# Altium schematic sheet geneva-interface.SchDoc
size A4
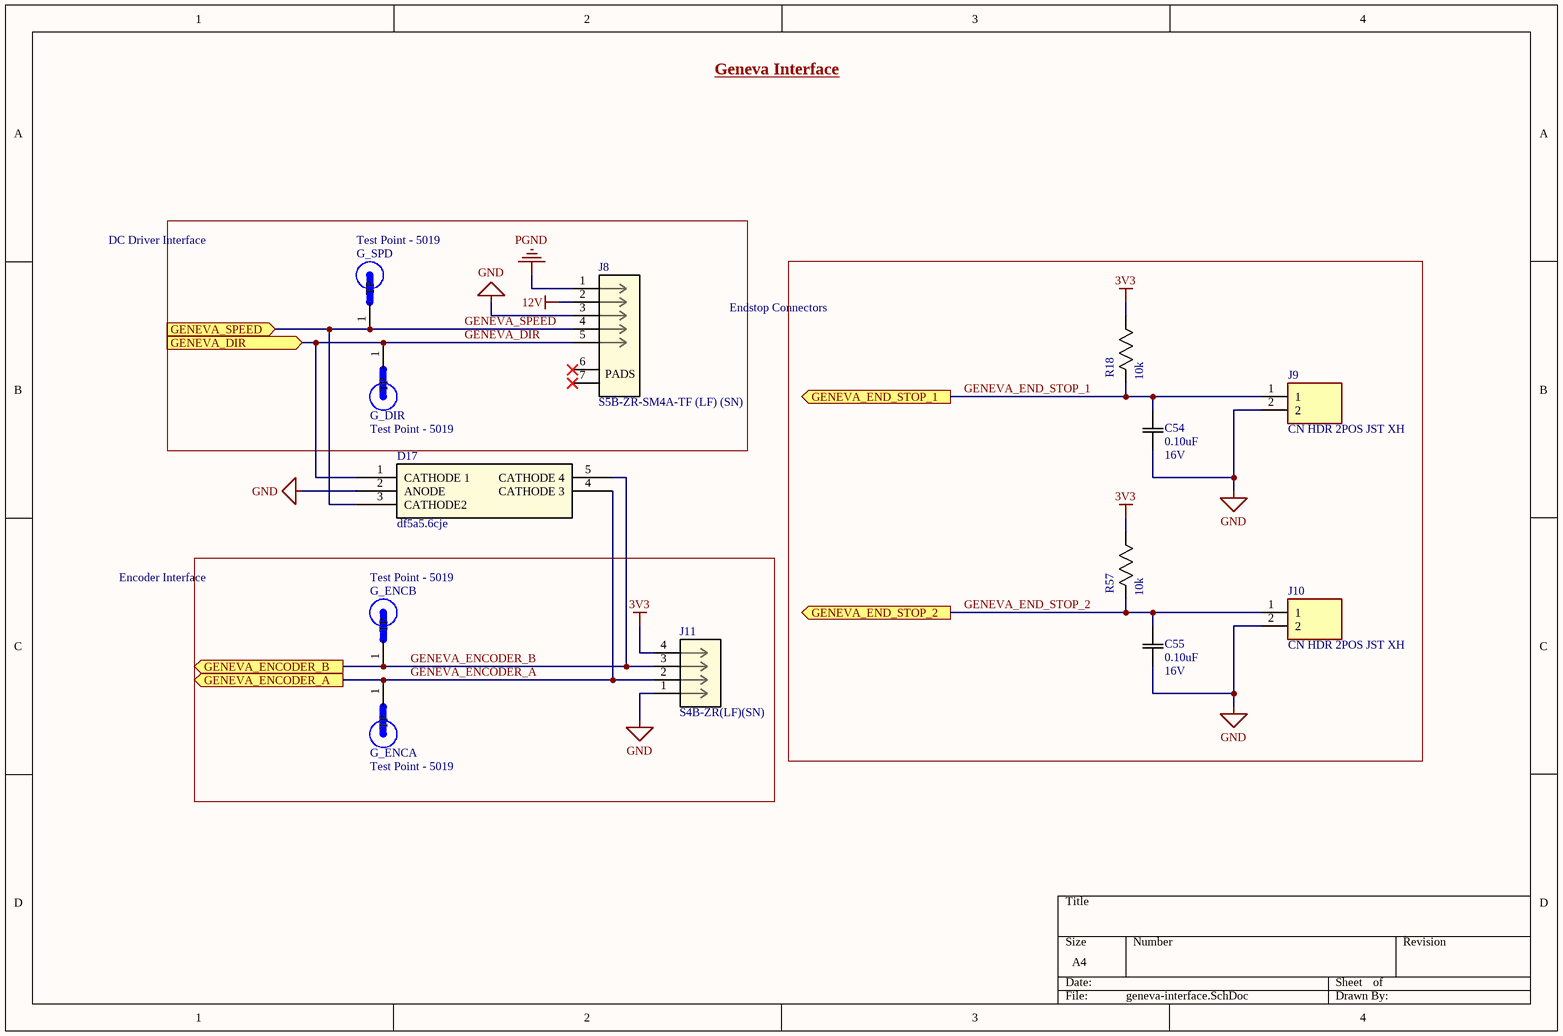
[diagram p0: geneva-interface.SchDoc]

## Parts
C54  Rating: 16V  [0603]  (hidden comment: 0.10uF)
C55  Rating: 16V  [0603]  (hidden comment: 0.10uF)
D17  df5a5.6cje  [ESV_TOS-L]
G_DIR  Test Point - 5019  [TP380X203]
G_ENCA  Test Point - 5019  [TP380X203]
G_ENCB  Test Point - 5019  [TP380X203]
G_SPD  Test Point - 5019  [TP380X203]
J8  S5B-ZR-SM4A-TF (LF) (SN)  [JST_S5B-ZR-SM4A-TF]
J9  CN HDR 2POS JST XH  [JST_S2B-XH-A(LF)(SN)]
J10  CN HDR 2POS JST XH  [JST_S2B-XH-A(LF)(SN)]
J11  S4B-ZR(LF)(SN)  [CN S4B-ZR(LF)(SN)_JST]
R18  10k  [0603]
R57  10k  [0603]

## Blocks framed on the sheet
DC Driver Interface: G_DIR G_SPD J8
Endstop Connectors: C54 C55 J9 J10 R18 R57
Encoder Interface: G_ENCA G_ENCB J11

## Ports
GENEVA_DIR (in), GENEVA_ENCODER_A (out), GENEVA_ENCODER_B (out), GENEVA_END_STOP_1 (out), GENEVA_END_STOP_2 (out), GENEVA_SPEED (in)

## Nets
3V3: J11.4 R18.1(R1) R57.1(R1)
12V: J8.2
GND: C54.2(C2) C55.2(C2) D17.2(ANODE) J8.3 J9.2 J10.2 J11.1
PGND: J8.1
GENEVA_DIR: D17.1(CATHODE_1) G_DIR.1(TP) J8.5 ; port GENEVA_DIR
GENEVA_ENCODER_A: D17.4(CATHODE_3) G_ENCA.1(TP) J11.2 ; port GENEVA_ENCODER_A
GENEVA_ENCODER_B: D17.5(CATHODE_4) G_ENCB.1(TP) J11.3 ; port GENEVA_ENCODER_B
GENEVA_END_STOP_1: C54.1(C1) J9.1 R18.2(R2) ; port GENEVA_END_STOP_1
GENEVA_END_STOP_2: C55.1(C1) J10.1 R57.2(R2) ; port GENEVA_END_STOP_2
GENEVA_SPEED: D17.3(CATHODE2) G_SPD.1(TP) J8.4 ; port GENEVA_SPEED

Not connected (* = marked no-connect by the designer): J8 6* 7*

## Notes on the sheet
- Geneva Interface
- (in symbol CN 5POS JST ZR RA) PADS

## Library data of the parts
C54 C55 = CAP 0.10uF 16V: CAP CER 0.10UF 16V X5R 0603; Tolerance: 10%; Package: 0603/0805; Temperature Coefficient: X5R; Operating Temperature: -55°C ~ 85°C; Value: 0.10uF; Part Number: CAP 0.10uF 16V
D17 = DIODE TVS 3.5 VWM 4 Channel: - Clamp - Ipp Tvs Diode Surface Mount ESV 4 Channel; Mfr_Name: Toshiba Electronic Devices & Storage Co.; Manufacturer_Part_Number: df5a5.6cje(te85l; Manufacturer Part Number 1: DF5A5.6CJE,LM; Type: DEV; Copyright: Copyright (C) 2021 Ultra Librarian. All rights reserved.; Digi-Key_Part_Number_1: DF5A5.6CJE(TE85LF)TR-ND; Digi-Key_Part_Number_2: DF5A5.6CJE(TE85LF)CT-ND; Digi-Key_Part_Number_3: DF5A5.6CJE(TE85LF)DKR-ND; RefDes: RefDes; Supplier 1: Digi-Key; Supplier Part Number 1: DF5A5.6CJE,LMCT-ND; Part Number: DIODE TVS 3.5 VWM 4 Channel; Supplier URL 1: https://www.digikey.com/en/products/detail/toshiba-semiconductor-and-storage/DF5A5-6CJE-LM/4305072
G_DIR G_ENCA G_ENCB G_SPD = Test Point - 5019: PC Test Point, Miniature Phosphor Bronze, Silver Plating Surface Mount Mounting Type; MP: 5019; MF: Keystone Electronics; Value: *; Package: 2010 Keystone; Part Number: Test Point - 5019
J8 = CN 5POS JST ZR RA: Connector Header Surface Mount, Right Angle 5 position 0.059" (1.50mm); Supplier 1: Digi-Key; Supplier Part Number 1: 455-1696-1-ND; Part Number: CN 5POS JST ZR RA; Manufacturer Part Number 1: S5B-ZR-SM4A-TF; Supplier URL 1: https://www.digikey.ca/en/products/detail/jst-sales-america-inc/S5B-ZR-SM4A-TF-LF-SN/926603?s=N4IgTCBcDaICwFYEFoCMA2AnOtyByAIiALoC%2BQA; Pin Count: 5
J9 J10 = CN HDR 2POS JST XH: Connector Header Through Hole 2 position 0.098 _2.50mm_ / JST XH; MP: B2B-XH-A_LF__SN_; MF: JST Sales; Price: None; Package: None; Value: *; SnapEDA_Link: https://www.snapeda.com/parts/B2B-XH-A%28LF%29%28SN%29/JST%20Sales%20America%20Inc./view-part/492310/?ref=snap; Part Number: CN HDR 2POS JST XH; Pin Count: 2
J11 = CN HDR 4POS JST ZR: Connector Header Through Hole, Right Angle 4 position 0.059" (1.50mm); Mfr_Name: JST; Copyright: Copyright (C) 2021 Ultra Librarian. All rights reserved.; Manufacturer_Part_Number: S4B-ZR(LF)(SN); Digi-Key_Part_Number_1: 455-1671-ND; RefDes: RefDes; Type: DEV; Supplier 1: Digi-Key; Supplier Part Number 1: 455-1671-ND; Part Number: CN HDR 4POS JST ZR; Manufacturer Part Number 1: S4B-ZR(LF)(SN); Supplier URL 1: https://www.digikey.com/en/products/detail/jst-sales-america-inc/S4B-ZR-LF-SN/926578
R18 R57 = RES 10k 1/8W - 5%: RES SMD 10K OHM 5% 1/8W 0603; Power (Watts): 0.125W; Package: 0805; Value: 10k; Tolerance: 5%; Part Number: RES 10k 1/8W - 5%